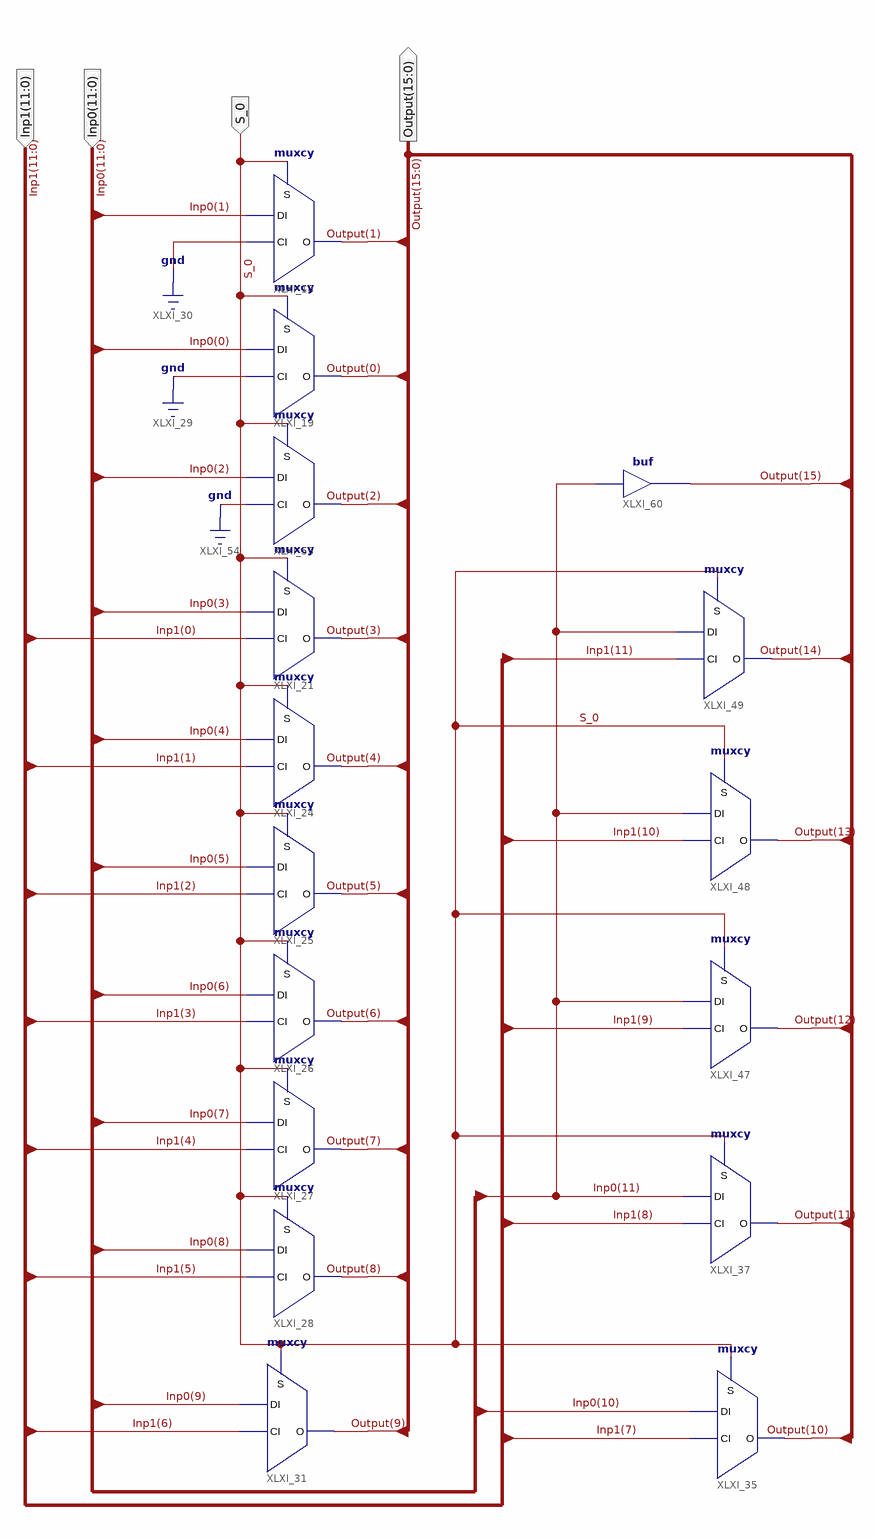
[diagram p0: schematic sheet 1]
// Xilinx ISE schematic Multiplier_8.sch (spartan3e) as structural Verilog: 16 symbols, 4 ports
module Multiplier_8 (
  input  [11:0] Inp1,
  input  [11:0] Inp0,
  input  S_0,
  output [15:0] Output
);

  muxcy XLXI_18 (.CI(1'b0), .DI(Inp0[1]), .S(S_0), .O(Output[1]));
  muxcy XLXI_21 (.CI(Inp1[0]), .DI(Inp0[3]), .S(S_0), .O(Output[3]));
  muxcy XLXI_24 (.CI(Inp1[1]), .DI(Inp0[4]), .S(S_0), .O(Output[4]));
  muxcy XLXI_25 (.CI(Inp1[2]), .DI(Inp0[5]), .S(S_0), .O(Output[5]));
  muxcy XLXI_26 (.CI(Inp1[3]), .DI(Inp0[6]), .S(S_0), .O(Output[6]));
  muxcy XLXI_27 (.CI(Inp1[4]), .DI(Inp0[7]), .S(S_0), .O(Output[7]));
  muxcy XLXI_28 (.CI(Inp1[5]), .DI(Inp0[8]), .S(S_0), .O(Output[8]));
  muxcy XLXI_19 (.CI(1'b0), .DI(Inp0[0]), .S(S_0), .O(Output[0]));
  muxcy XLXI_35 (.CI(Inp1[7]), .DI(Inp0[10]), .S(S_0), .O(Output[10]));
  muxcy XLXI_37 (.CI(Inp1[8]), .DI(Inp0[11]), .S(S_0), .O(Output[11]));
  muxcy XLXI_31 (.CI(Inp1[6]), .DI(Inp0[9]), .S(S_0), .O(Output[9]));
  muxcy XLXI_47 (.CI(Inp1[9]), .DI(Inp0[11]), .S(S_0), .O(Output[12]));
  muxcy XLXI_48 (.CI(Inp1[10]), .DI(Inp0[11]), .S(S_0), .O(Output[13]));
  muxcy XLXI_53 (.CI(1'b0), .DI(Inp0[2]), .S(S_0), .O(Output[2]));
  muxcy XLXI_49 (.CI(Inp1[11]), .DI(Inp0[11]), .S(S_0), .O(Output[14]));
  buf XLXI_60 (Output[15], Inp0[11]);
endmodule
